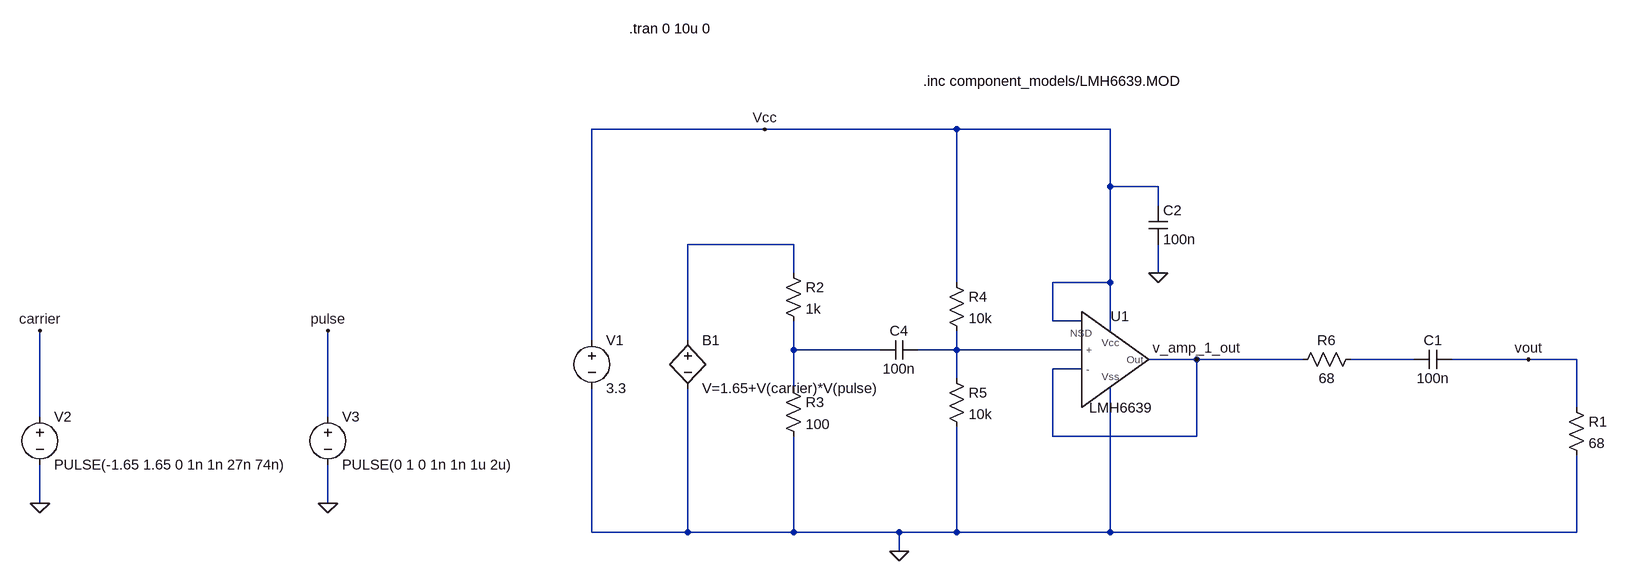
[diagram p0: schematic delay_line_output.asc]
delay_line_output.asc, the LTspice schematic file:
Version 4
SHEET 1 1768 680
WIRE -256 -208 -544 -208
WIRE 64 -208 -256 -208
WIRE 320 -208 64 -208
WIRE 320 -112 320 -208
WIRE 400 -112 320 -112
WIRE 400 -80 400 -112
WIRE -208 -16 -384 -16
WIRE -208 32 -208 -16
WIRE 400 32 400 -16
WIRE 64 48 64 -208
WIRE 320 48 320 -112
WIRE 320 48 224 48
WIRE 224 112 224 48
WIRE 272 112 224 112
WIRE 320 128 320 48
WIRE -544 144 -544 -208
WIRE -384 144 -384 -16
WIRE -208 160 -208 112
WIRE -64 160 -208 160
WIRE 64 160 64 128
WIRE 64 160 0 160
WIRE 272 160 64 160
WIRE 464 176 384 176
WIRE 704 176 464 176
WIRE 1424 176 784 176
WIRE 1632 176 1488 176
WIRE 1712 176 1632 176
WIRE 272 192 224 192
WIRE 64 208 64 160
WIRE -208 224 -208 160
WIRE 1712 256 1712 176
WIRE -2144 272 -2144 128
WIRE -1664 272 -1664 128
WIRE 224 304 224 192
WIRE 464 304 464 176
WIRE 464 304 224 304
WIRE -2144 416 -2144 352
WIRE -1664 416 -1664 352
WIRE -544 464 -544 224
WIRE -384 464 -384 224
WIRE -384 464 -544 464
WIRE -208 464 -208 304
WIRE -208 464 -384 464
WIRE -32 464 -208 464
WIRE 64 464 64 288
WIRE 64 464 -32 464
WIRE 320 464 320 224
WIRE 320 464 64 464
WIRE 1712 464 1712 336
WIRE 1712 464 320 464
WIRE -32 496 -32 464
FLAG -32 496 0
FLAG -2144 416 0
FLAG -1664 416 0
FLAG -2144 128 carrier
FLAG -1664 128 pulse
FLAG -256 -208 Vcc
FLAG 400 32 0
FLAG 464 176 v_amp_1_out
FLAG 1632 176 vout
SYMBOL voltage -544 128 R0
WINDOW 123 0 0 Left 2
WINDOW 39 0 0 Left 2
SYMATTR InstName V1
SYMATTR Value 3.3
SYMBOL res 1696 240 R0
SYMATTR InstName R1
SYMATTR Value 68
SYMBOL res -224 16 R0
SYMATTR InstName R2
SYMATTR Value 1k
SYMBOL res -224 208 R0
SYMATTR InstName R3
SYMATTR Value 100
SYMBOL voltage -2144 256 R0
WINDOW 123 0 0 Left 2
WINDOW 39 0 0 Left 2
SYMATTR InstName V2
SYMATTR Value PULSE(-1.65 1.65 0 1n 1n 27n 74n)
SYMBOL voltage -1664 256 R0
WINDOW 123 0 0 Left 2
WINDOW 39 0 0 Left 2
SYMATTR InstName V3
SYMATTR Value PULSE(0 1 0 1n 1n 1u 2u)
SYMBOL bv -384 128 R0
SYMATTR InstName B1
SYMATTR Value V=1.65+V(carrier)*V(pulse)
SYMBOL cap 384 -80 R0
SYMATTR InstName C2
SYMATTR Value 100n
SYMBOL LMH6639 336 176 R0
SYMATTR InstName U1
SYMBOL cap 1488 160 R90
WINDOW 0 0 32 VBottom 2
WINDOW 3 32 32 VTop 2
SYMATTR InstName C1
SYMATTR Value 100n
SYMBOL cap 0 144 R90
WINDOW 0 0 32 VBottom 2
WINDOW 3 32 32 VTop 2
SYMATTR InstName C4
SYMATTR Value 100n
SYMBOL res 48 32 R0
SYMATTR InstName R4
SYMATTR Value 10k
SYMBOL res 48 192 R0
SYMATTR InstName R5
SYMATTR Value 10k
SYMBOL res 800 160 R90
WINDOW 0 0 56 VBottom 2
WINDOW 3 32 56 VTop 2
SYMATTR InstName R6
SYMATTR Value 68
TEXT 8 -288 Left 2 !.inc component_models/LMH6639.MOD
TEXT -482 -376 Left 2 !.tran 0 10u 0

The netlist it stands for:
* delay_line_output.asc
V1 Vcc 0 3.3
R1 vout 0 68
R2 N001 N002 1k
R3 N002 0 100
V2 carrier 0 PULSE(-1.65 1.65 0 1n 1n 27n 74n)
V3 pulse 0 PULSE(0 1 0 1n 1n 1u 2u)
B1 N001 0 V=1.65+V(carrier)*V(pulse)
C2 Vcc 0 100n
XU1 N003 v_amp_1_out Vcc 0 v_amp_1_out Vcc LMH6639  ; pins + - Vcc Vss Out NSD
C1 vout N004 100n
C4 N003 N002 100n
R4 Vcc N003 10k
R5 N003 0 10k
R6 N004 v_amp_1_out 68
.inc component_models/LMH6639.MOD
.tran 0 10u 0
.lib Z:\home\josh\to_spice\component_models\MCP661.inc
.backanno
.end